# Altium schematic sheet [01]MCU.SchDoc
size A4; Organization: Altium Limited; Address1: L3, 12a Rodborough Rd; Address2: Frenchs Forest; Address3: NSW; Address4: Australia 2086
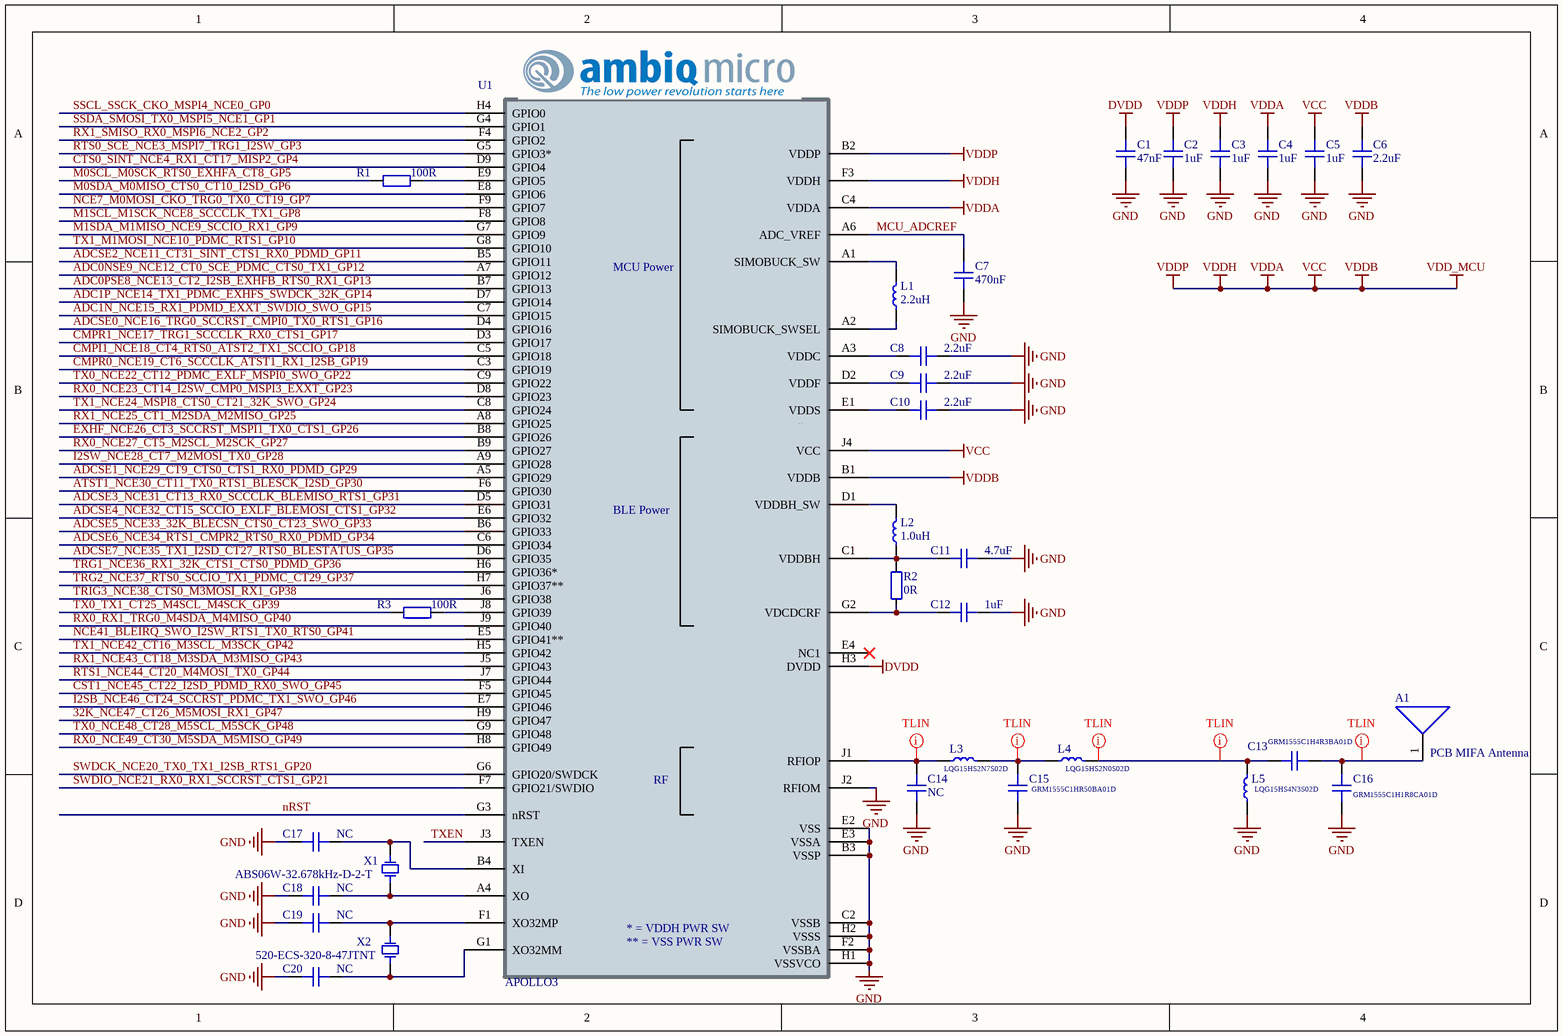
[diagram p0: [01]MCU.SchDoc]

## Parts
A1  PCB MIFA Antenna  [MIFA_AMBIQ]  (net tie, no BOM)
C1  47nF  [CAPC1005L]
C2  1uF  [CAPC1005L]
C3  1uF  [CAPC1005L]
C4  1uF  [CAPC1005L]
C5  1uF  [CAPC1005L]
C6  2.2uF  [CAPC1005L]
C7  470nF  [CAPC1005L]
C8  2.2uF  [CAPC1005L]
C9  2.2uF  [CAPC1005L]
C10  2.2uF  [CAPC1005L]
C11  4.7uF  [CAPC1005L]
C12  1uF  [CAPC1005L]
C13  GRM1555C1H4R3BA01D  [CAPC1005L]
C14  NC  [CAPC1005L]
C15  GRM1555C1HR50BA01D  [CAPC1005L]
C16  GRM1555C1H1R8CA01D  [CAPC1005L]
C17  NC  [CAPC1005L]
C18  NC  [CAPC1005L]
C19  NC  [CAPC1005L]
C20  NC  [CAPC1005L]
L1  2.2uH  [BRC2012]
L2  1.0uH  [DFE18SAN]
L3  LQG15HS2N7S02D  [INDC1005L]
L4  LQG15HS2N0S02D  [INDC1005L]
L5  LQG15HS4N3S02D  [INDC1005L]
R1  100R  [RESC1005L]
R2  0R  [RESC1005L]
R3  100R  [RESC1005L]
U1  APOLLO3  [BGA81C50P9X9_500X500X80]
X1  ABS06W-32.678kHz-D-2-T  [ABS06W]
X2  520-ECS-320-8-47JTNT  [ECX-1247]

## Nets
DVDD: C1.2 U1.H3(DVDD)
GND: C1.1 C2.1 C3.1 C4.1 C5.1 C6.1 C7.1 C8.1 C9.1 C10.1 C11.1 C12.1 C14.2 C15.2 C16.2 C17.2 C18.2 C19.2 C20.2 L5.1 U1.B3(VSSP) U1.C2(VSSB) U1.E2(VSS) U1.E3(VSSA) U1.F2(VSSBA) U1.H1(VSSVCO) U1.H2(VSSS) U1.J2(RFIOM) X2.2(GND) X2.4(GND)
VCC: C2.2 C3.2 C4.2 C5.2 C6.2 U1.B1(VDDB) U1.B2(VDDP) U1.C4(VDDA) U1.F3(VDDH) U1.J4(VCC)  [also labelled VDD_MCU, VDDA, VDDB, VDDH, VDDP]
32K_NCE47_CT26_M5MOSI_RX1_GP47: U1.H9(GPIO47)
ADC0NSE9_NCE12_CT0_SCE_PDMC_CTS0_TX1_GP12: U1.A7(GPIO12)
ADC0PSE8_NCE13_CT2_I2SB_EXHFB_RTS0_RX1_GP13: U1.B7(GPIO13)
ADC1N_NCE15_RX1_PDMD_EXXT_SWDIO_SWO_GP15: U1.C7(GPIO15)
ADC1P_NCE14_TX1_PDMC_EXHFS_SWDCK_32K_GP14: U1.D7(GPIO14)
ADCSE0_NCE16_TRG0_SCCRST_CMPI0_TX0_RTS1_GP16: U1.D4(GPIO16)
ADCSE1_NCE29_CT9_CTS0_CTS1_RX0_PDMD_GP29: U1.A5(GPIO29)
ADCSE2_NCE11_CT31_SINT_CTS1_RX0_PDMD_GP11: U1.B5(GPIO11)
ADCSE3_NCE31_CT13_RX0_SCCCLK_BLEMISO_RTS1_GP31: U1.D5(GPIO31)
ADCSE4_NCE32_CT15_SCCIO_EXLF_BLEMOSI_CTS1_GP32: U1.E6(GPIO32)
ADCSE5_NCE33_32K_BLECSN_CTS0_CT23_SWO_GP33: U1.B6(GPIO33)
ADCSE6_NCE34_RTS1_CMPR2_RTS0_RX0_PDMD_GP34: U1.C6(GPIO34)
ADCSE7_NCE35_TX1_I2SD_CT27_RTS0_BLESTATUS_GP35: U1.D6(GPIO35)
ATST1_NCE30_CT11_TX0_RTS1_BLESCK_I2SD_GP30: U1.F6(GPIO30)
CMPI1_NCE18_CT4_RTS0_ATST2_TX1_SCCIO_GP18: U1.C5(GPIO18)
CMPR0_NCE19_CT6_SCCCLK_ATST1_RX1_I2SB_GP19: U1.C3(GPIO19)
CMPR1_NCE17_TRG1_SCCCLK_RX0_CTS1_GP17: U1.D3(GPIO17)
CST1_NCE45_CT22_I2SD_PDMD_RX0_SWO_GP45: U1.F5(GPIO45)
CTS0_SINT_NCE4_RX1_CT17_MISP2_GP4: U1.D9(GPIO4)
EXHF_NCE26_CT3_SCCRST_MSPI1_TX0_CTS1_GP26: U1.B8(GPIO26)
I2SB_NCE46_CT24_SCCRST_PDMC_TX1_SWO_GP46: U1.E7(GPIO46)
I2SW_NCE28_CT7_M2MOSI_TX0_GP28: U1.A9(GPIO28)
M0SCL_M0SCK_RTS0_EXHFA_CT8_GP5: R1.1
M0SDA_M0MISO_CTS0_CT10_I2SD_GP6: U1.E8(GPIO6)
M1SCL_M1SCK_NCE8_SCCCLK_TX1_GP8: U1.F8(GPIO8)
M1SDA_M1MISO_NCE9_SCCIO_RX1_GP9: U1.G7(GPIO9)
MCU_ADCREF: C7.2 U1.A6(ADC_VREF)
NCE7_M0MOSI_CKO_TRG0_TX0_CT19_GP7: U1.F9(GPIO7)
NCE41_BLEIRQ_SWO_I2SW_RTS1_TX0_RTS0_GP41: U1.E5(GPIO41**)
nRST: U1.G3(nRST)
RTS0_SCE_NCE3_MSPI7_TRG1_I2SW_GP3: U1.G5(GPIO3*)
RTS1_NCE44_CT20_M4MOSI_TX0_GP44: U1.J7(GPIO44)
RX0_NCE23_CT14_I2SW_CMP0_MSPI3_EXXT_GP23: U1.D8(GPIO23)
RX0_NCE27_CT5_M2SCL_M2SCK_GP27: U1.B9(GPIO27)
RX0_NCE49_CT30_M5SDA_M5MISO_GP49: U1.H8(GPIO49)
RX0_RX1_TRG0_M4SDA_M4MISO_GP40: U1.J9(GPIO40)
RX1_NCE25_CT1_M2SDA_M2MISO_GP25: U1.A8(GPIO25)
RX1_NCE43_CT18_M3SDA_M3MISO_GP43: U1.J5(GPIO43)
RX1_SMISO_RX0_MSPI6_NCE2_GP2: U1.F4(GPIO2)
SSCL_SSCK_CKO_MSPI4_NCE0_GP0: U1.H4(GPIO0)
SSDA_SMOSI_TX0_MSPI5_NCE1_GP1: U1.G4(GPIO1)
SWDCK_NCE20_TX0_TX1_I2SB_RTS1_GP20: U1.G6(GPIO20/SWDCK)
SWDIO_NCE21_RX0_RX1_SCCRST_CTS1_GP21: U1.F7(GPIO21/SWDIO)
TRG1_NCE36_RX1_32K_CTS1_CTS0_PDMD_GP36: U1.H6(GPIO36*)
TRG2_NCE37_RTS0_SCCIO_TX1_PDMC_CT29_GP37: U1.H7(GPIO37**)
TRIG3_NCE38_CTS0_M3MOSI_RX1_GP38: U1.J6(GPIO38)
TX0_NCE22_CT12_PDMC_EXLF_MSPI0_SWO_GP22: U1.C9(GPIO22)
TX0_NCE48_CT28_M5SCL_M5SCK_GP48: U1.G9(GPIO48)
TX0_TX1_CT25_M4SCL_M4SCK_GP39: R3.1
TX1_M1MOSI_NCE10_PDMC_RTS1_GP10: U1.G8(GPIO10)
TX1_NCE24_MSPI8_CTS0_CT21_32K_SWO_GP24: U1.C8(GPIO24)
TX1_NCE42_CT16_M3SCL_M3SCK_GP42: U1.H5(GPIO42)
TXEN: U1.J3(TXEN)
NetA1_1: A1.1 C13.2 C16.1
NetC8_2: C8.2 U1.A3(VDDC)
NetC9_2: C9.2 U1.D2(VDDF)
NetC10_2: C10.2 U1.E1(VDDS)
NetC11_2: C11.2 L2.1 R2.2 U1.C1(VDDBH)
NetC12_2: C12.2 R2.1 U1.G2(VDCDCRF)
NetC13_1: C13.1 L4.2 L5.2
NetC14_1: C14.1 L3.1 U1.J1(RFIOP)
NetC15_1: C15.1 L3.2 L4.1
NetC17_1: C17.1 U1.B4(XI) X1.2
NetC18_1: C18.1 U1.A4(XO) X1.1
NetC19_1: C19.1 U1.F1(XO32MP) X2.3
NetC20_1: C20.1 U1.G1(XO32MM) X2.1
NetL1_1: L1.1 U1.A2(SIMOBUCK_SWSEL)
NetL1_2: L1.2 U1.A1(SIMOBUCK_SW)
NetL2_2: L2.2 U1.D1(VDDBH_SW)
NetR1_2: R1.2 U1.E9(GPIO5)
NetR3_2: R3.2 U1.J8(GPIO39)

Not connected (* = marked no-connect by the designer): U1 E4(NC1)*

## Layout directives
net class TLIN50: NetA1_1, NetC13_1, NetC14_1, NetC15_1

## Notes on the sheet
- Title
- Size:
- Date:
- A3
- Number:
- Time:
- Revision:
- Sheet
- of
- File:
- (in symbol APOLLO3-BGA) MCU Power; BLE Power; RF; * = VDDH PWR SW; ** = VSS PWR SW

## Library data of the parts
A1 = ANT_PCB: 2.4G Printed Antenna
C1-C20 = CAP_CHP: Surface Mount Unpolarized Capacitor
L1 = IND_PWR: DFE201610E-2R2M=P2
L2 = IND_PWR: DFE18SAN1R0MG0L
L3-L5 = IND_CHP: Chip Inductor
R1-R3 = RES_CHP: Surface Mount Resistor
U1 = APOLLO3-BGA: Manufacturer: Ambiq Micro; Part Number: APOLLO3; Value: APOLLO3
X1 = ABS06W-32.678kHz-D-2-T: 32.768KHZ IoT OPTIMIZED SMD CRYSTA
X2 = ECX-1247: XTAL 32MHZ 8pF 20ppm  1.6mm x 1.2mm x 0.35mm SMT